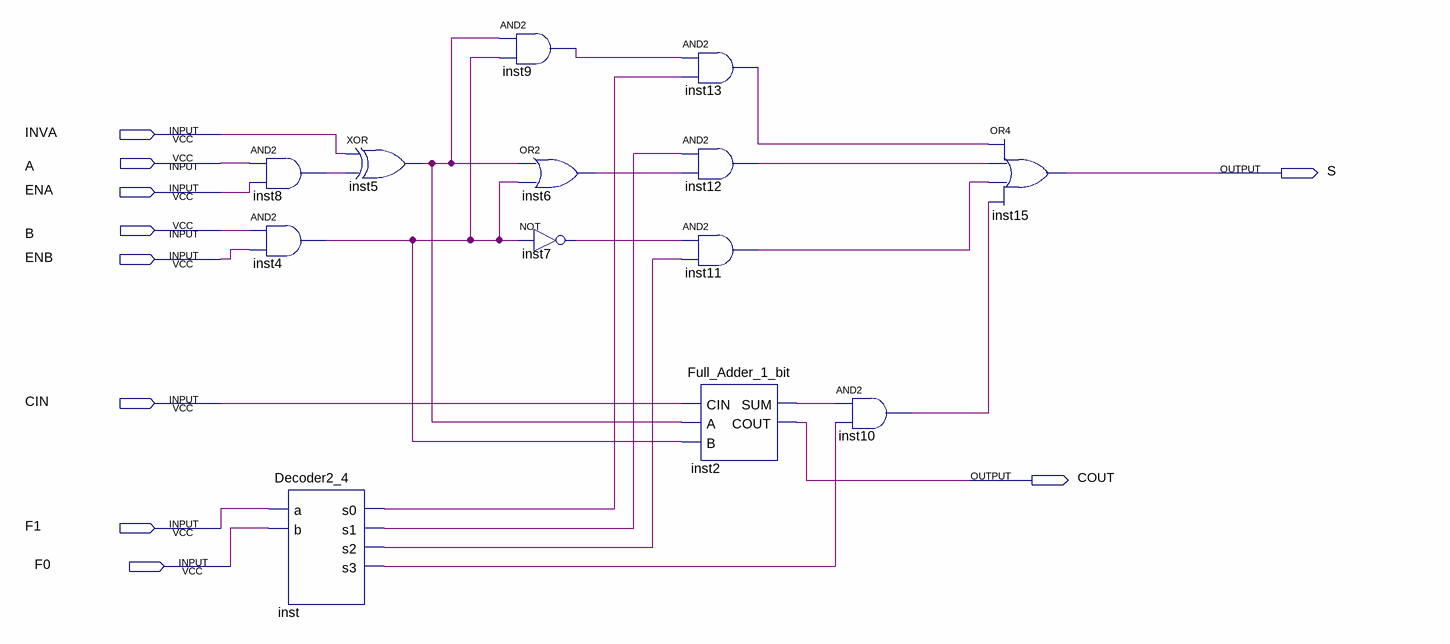
[diagram p0: schematic sheet]
// Quartus schematic Ula_1bit.bdf as structural Verilog: 13 symbols, 10 pins
module Ula_1bit (
  input  INVA,
  input  A,
  input  ENA,
  input  B,
  input  ENB,
  input  CIN,
  input  F1,
  input  F0,
  output S,
  output COUT
);

  wire inst2_sum, inst4_out, inst5_out, inst6_out, inst7_out, inst8_out, inst9_out, inst10_out, inst11_out,
       inst12_out, inst13_out, inst_s0, inst_s1, inst_s2, inst_s3;

  and inst8 (inst8_out, A, ENA);
  and inst4 (inst4_out, B, ENB);
  Decoder2_4 inst (.a(F1), .b(F0), .s0(inst_s0), .s1(inst_s1), .s2(inst_s2), .s3(inst_s3));
  xor inst5 (inst5_out, INVA, inst8_out);
  and inst9 (inst9_out, inst5_out, inst4_out);
  or inst6 (inst6_out, inst5_out, inst4_out);
  not inst7 (inst7_out, inst4_out);
  and inst13 (inst13_out, inst9_out, inst_s0);
  and inst12 (inst12_out, inst_s1, inst6_out);
  and inst11 (inst11_out, inst7_out, inst_s2);
  Full_Adder_1_bit inst2 (.CIN(CIN), .A(inst5_out), .B(inst4_out), .SUM(inst2_sum), .COUT(COUT));
  and inst10 (inst10_out, inst2_sum, inst_s3);
  or inst15 (S, inst13_out, inst12_out, inst11_out, inst10_out);
endmodule
